# Altium schematic sheet 32.SchDoc
size 594 x 420 mm; Scale: 1:1; Разраб.: Иванов; Обозначение документа: ГУИР.203719.145 Э3; Пров.: Петров; Утв.: Сидоров; Номер листа: 26; Наименование организации: ОАО "Концерн "МПО-Гидроприбор"; Наименование изделия 1: Плата; Наименование изделия 2: Схема электрическая; Наименование изделия 3: принципиальная; Нач. отд.: Нач. отд.; Фамилия нач. отд.: Сидоров
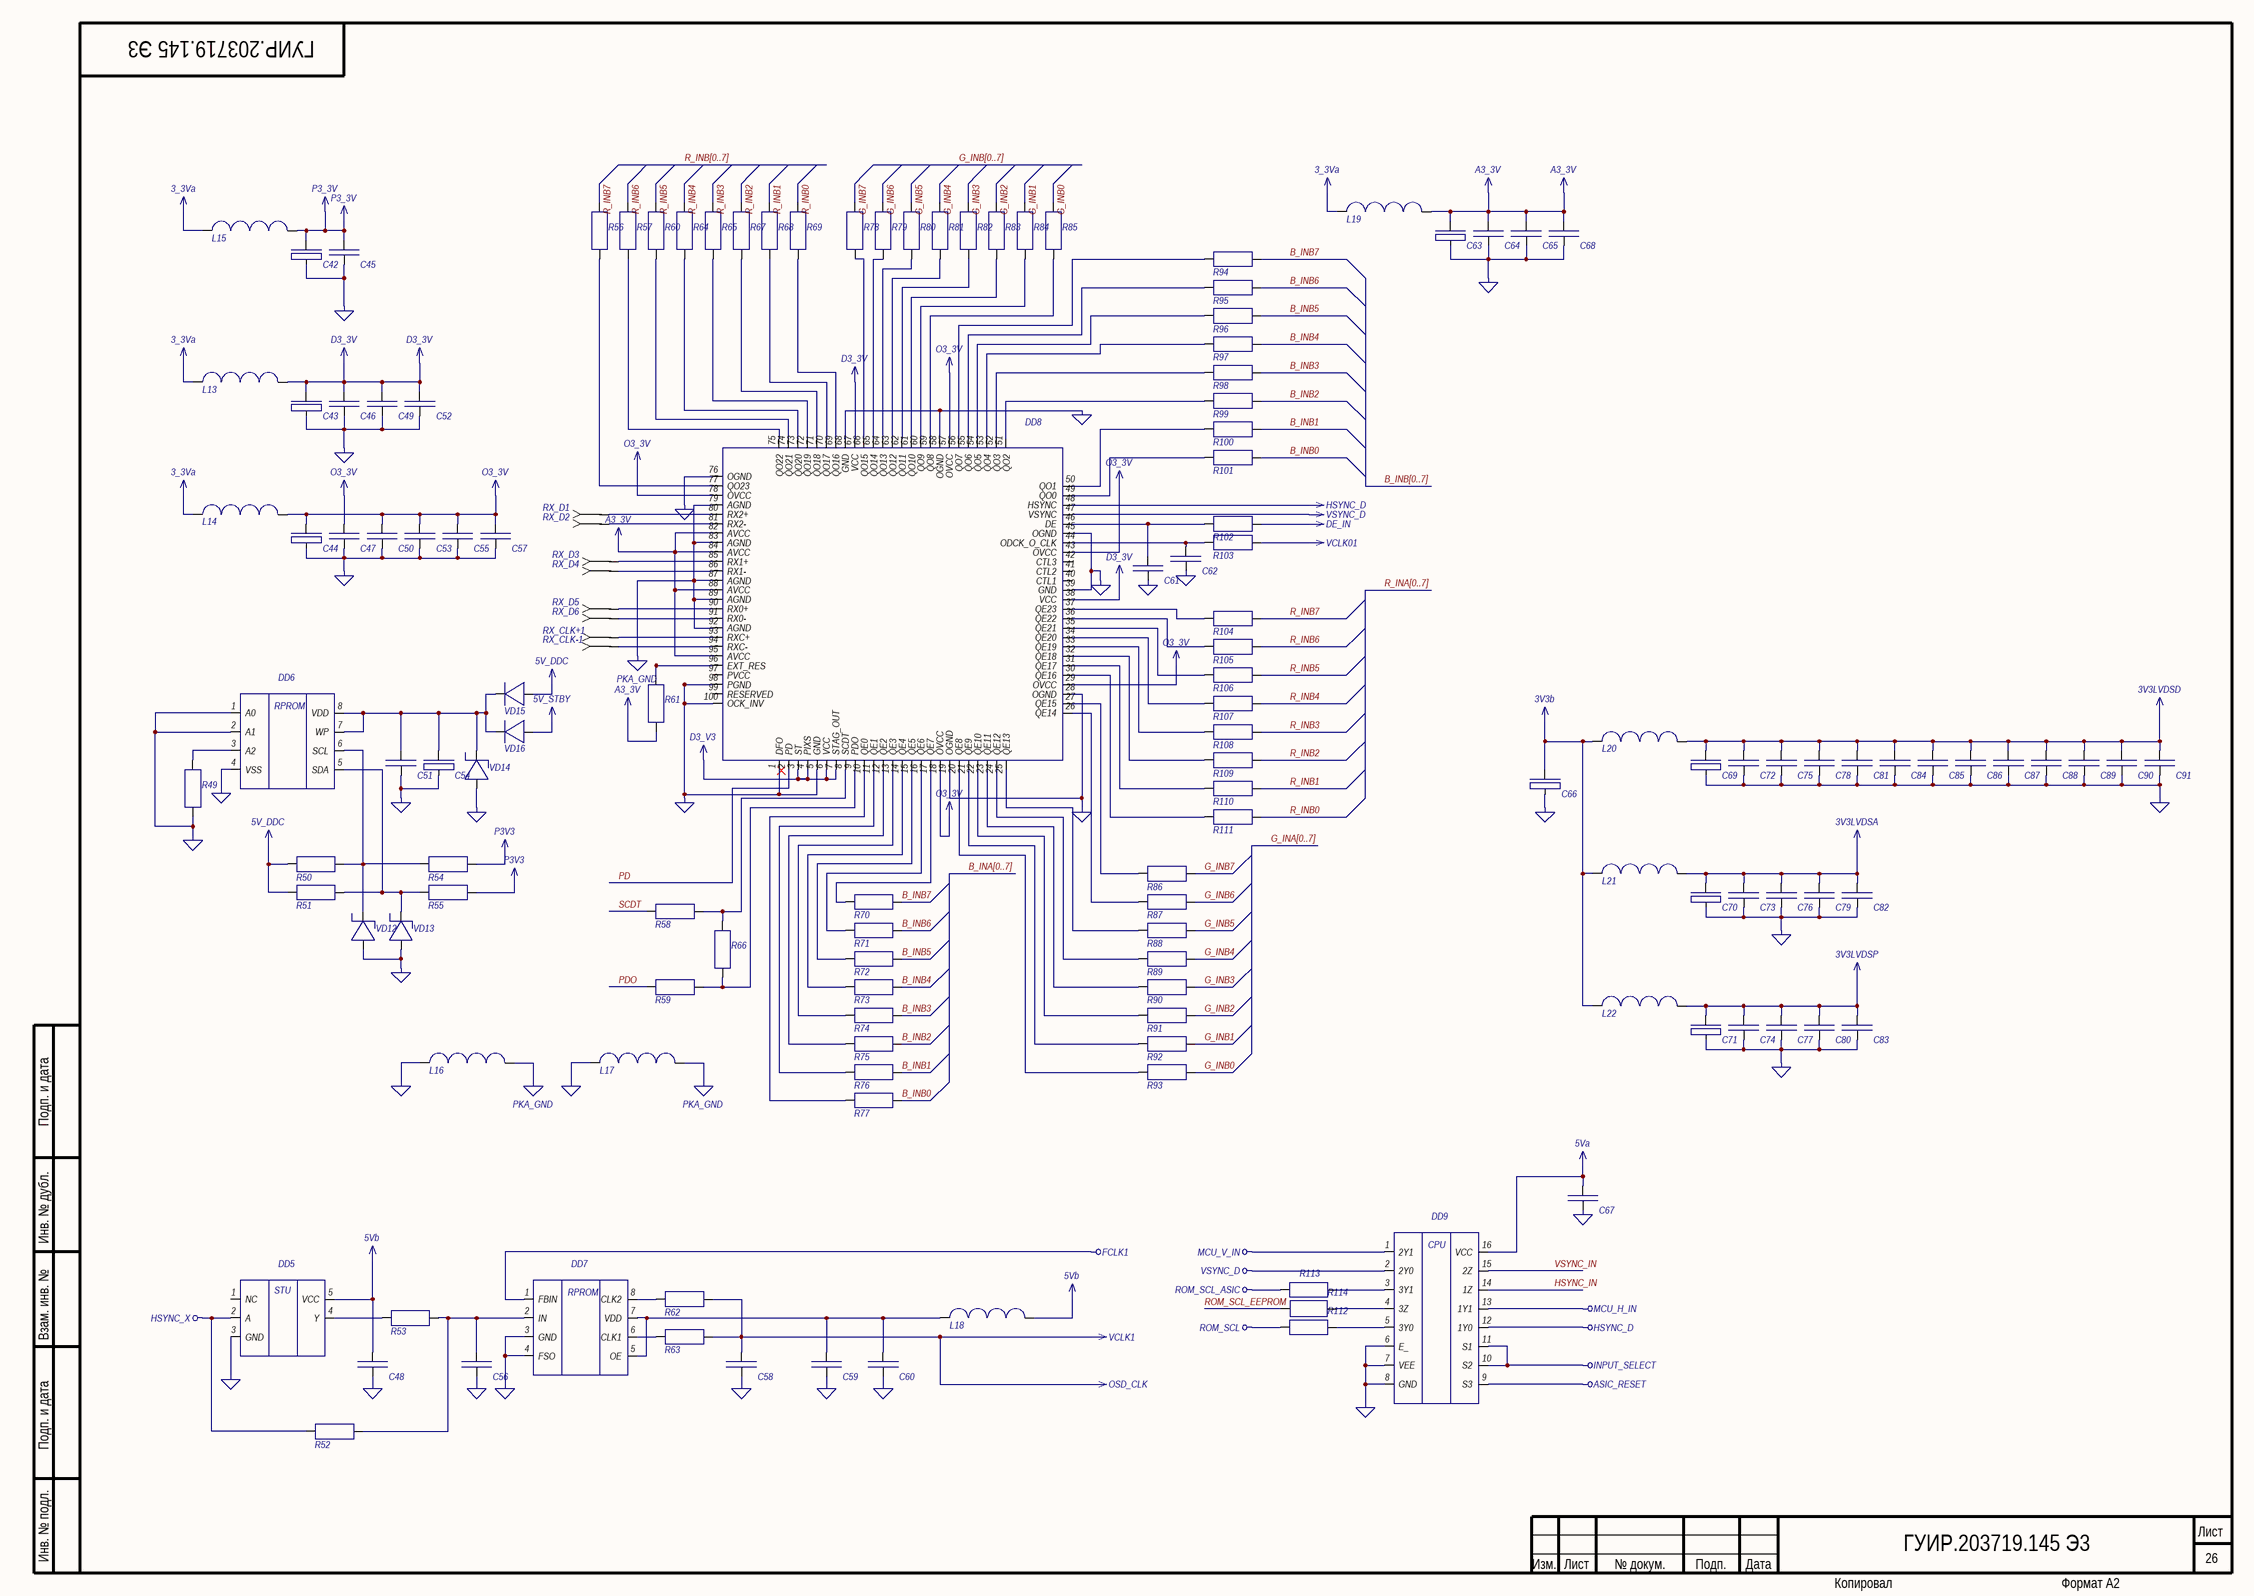
[diagram p0: 32.SchDoc]

## Parts
C42  TuningCapacitor  [Cap_tantal_D]  (value not drawn)
C43  TuningCapacitor  [Cap_tantal_D]  (value not drawn)
C44  TuningCapacitor  [Cap_tantal_D]  (value not drawn)
C45  Capacitor  [cap_electro_13]  (value not drawn)
C46  Capacitor  [cap_electro_13]  (value not drawn)
C47  Capacitor  [cap_electro_13]  (value not drawn)
C48  Capacitor  [cap_electro_13]  (value not drawn)
C49  Capacitor  [cap_electro_13]  (value not drawn)
C50  Capacitor  [cap_electro_13]  (value not drawn)
C51  Capacitor  [cap_electro_13]  (value not drawn)
C52  Capacitor  [cap_electro_13]  (value not drawn)
C53  Capacitor  [cap_electro_13]  (value not drawn)
C54  TuningCapacitor  [Cap_tantal_D]  (value not drawn)
C55  Capacitor  [cap_electro_13]  (value not drawn)
C56  Capacitor  [cap_electro_13]  (value not drawn)
C57  Capacitor  [cap_electro_13]  (value not drawn)
C58  Capacitor  [cap_electro_13]  (value not drawn)
C59  Capacitor  [cap_electro_13]  (value not drawn)
C60  Capacitor  [cap_electro_13]  (value not drawn)
C61  Capacitor  [cap_electro_13]  (value not drawn)
C62  Capacitor  [cap_electro_13]  (value not drawn)
C63  TuningCapacitor  [Cap_tantal_D]  (value not drawn)
C64  Capacitor  [cap_electro_13]  (value not drawn)
C65  Capacitor  [cap_electro_13]  (value not drawn)
C66  TuningCapacitor  [Cap_tantal_D]  (value not drawn)
C67  Capacitor  [cap_electro_13]  (value not drawn)
C68  Capacitor  [cap_electro_13]  (value not drawn)
C69  TuningCapacitor  [Cap_tantal_D]  (value not drawn)
C70  TuningCapacitor  [Cap_tantal_D]  (value not drawn)
C71  TuningCapacitor  [Cap_tantal_D]  (value not drawn)
C72  Capacitor  [cap_electro_13]  (value not drawn)
C73  Capacitor  [cap_electro_13]  (value not drawn)
C74  Capacitor  [cap_electro_13]  (value not drawn)
C75  Capacitor  [cap_electro_13]  (value not drawn)
C76  Capacitor  [cap_electro_13]  (value not drawn)
C77  Capacitor  [cap_electro_13]  (value not drawn)
C78  Capacitor  [cap_electro_13]  (value not drawn)
C79  Capacitor  [cap_electro_13]  (value not drawn)
C80  Capacitor  [cap_electro_13]  (value not drawn)
C81  Capacitor  [cap_electro_13]  (value not drawn)
C82  Capacitor  [cap_electro_13]  (value not drawn)
C83  Capacitor  [cap_electro_13]  (value not drawn)
C84  Capacitor  [cap_electro_13]  (value not drawn)
C85  Capacitor  [cap_electro_13]  (value not drawn)
C86  Capacitor  [cap_electro_13]  (value not drawn)
C87  Capacitor  [cap_electro_13]  (value not drawn)
C88  Capacitor  [cap_electro_13]  (value not drawn)
C89  Capacitor  [cap_electro_13]  (value not drawn)
C90  Capacitor  [cap_electro_13]  (value not drawn)
C91  Capacitor  [cap_electro_13]  (value not drawn)
DD5  F14-SINGLE  [74AHC1G14(SOT25)]  (value not drawn)
DD6  24C02  [24Cxx]  (value not drawn)
DD7  AV9173-01  [AV9173-01(DIP8)]  (value not drawn)
DD8  SIL151  [SIL151]  (value not drawn)
DD9  74LV4053  [74LV4053(SOT38-4)]  (value not drawn)
L13  Inductor  [inductor]  (value not drawn)
L14  Inductor  [inductor]  (value not drawn)
L15  Inductor  [inductor]  (value not drawn)
L16  Inductor  [inductor]  (value not drawn)
L17  Inductor  [inductor]  (value not drawn)
L18  Inductor  [inductor]  (value not drawn)
L19  Inductor  [inductor]  (value not drawn)
L20  Inductor  [inductor]  (value not drawn)
L21  Inductor  [inductor]  (value not drawn)
L22  Inductor  [inductor]  (value not drawn)
R49  Resistor  [R_1206]  (value not drawn)
R50  Resistor  [R_1206]  (value not drawn)
R51  Resistor  [R_1206]  (value not drawn)
R52  Resistor  [R_1206]  (value not drawn)
R53  Resistor  [R_1206]  (value not drawn)
R54  Resistor  [R_1206]  (value not drawn)
R55  Resistor  [R_1206]  (value not drawn)
R56  Resistor  [R_1206]  (value not drawn)
R57  Resistor  [R_1206]  (value not drawn)
R58  Resistor  [R_1206]  (value not drawn)
R59  Resistor  [R_1206]  (value not drawn)
R60  Resistor  [R_1206]  (value not drawn)
R61  Resistor  [R_1206]  (value not drawn)
R62  Resistor  [R_1206]  (value not drawn)
R63  Resistor  [R_1206]  (value not drawn)
R64  Resistor  [R_1206]  (value not drawn)
R65  Resistor  [R_1206]  (value not drawn)
R66  Resistor  [R_1206]  (value not drawn)
R67  Resistor  [R_1206]  (value not drawn)
R68  Resistor  [R_1206]  (value not drawn)
R69  Resistor  [R_1206]  (value not drawn)
R70  Resistor  [R_1206]  (value not drawn)
R71  Resistor  [R_1206]  (value not drawn)
R72  Resistor  [R_1206]  (value not drawn)
R73  Resistor  [R_1206]  (value not drawn)
R74  Resistor  [R_1206]  (value not drawn)
R75  Resistor  [R_1206]  (value not drawn)
R76  Resistor  [R_1206]  (value not drawn)
R77  Resistor  [R_1206]  (value not drawn)
R78  Resistor  [R_1206]  (value not drawn)
R79  Resistor  [R_1206]  (value not drawn)
R80  Resistor  [R_1206]  (value not drawn)
R81  Resistor  [R_1206]  (value not drawn)
R82  Resistor  [R_1206]  (value not drawn)
R83  Resistor  [R_1206]  (value not drawn)
R84  Resistor  [R_1206]  (value not drawn)
R85  Resistor  [R_1206]  (value not drawn)
R86  Resistor  [R_1206]  (value not drawn)
R87  Resistor  [R_1206]  (value not drawn)
R88  Resistor  [R_1206]  (value not drawn)
R89  Resistor  [R_1206]  (value not drawn)
R90  Resistor  [R_1206]  (value not drawn)
R91  Resistor  [R_1206]  (value not drawn)
R92  Resistor  [R_1206]  (value not drawn)
R93  Resistor  [R_1206]  (value not drawn)
R94  Resistor  [R_1206]  (value not drawn)
R95  Resistor  [R_1206]  (value not drawn)
R96  Resistor  [R_1206]  (value not drawn)
R97  Resistor  [R_1206]  (value not drawn)
R98  Resistor  [R_1206]  (value not drawn)
R99  Resistor  [R_1206]  (value not drawn)
R100  Resistor  [R_1206]  (value not drawn)
R101  Resistor  [R_1206]  (value not drawn)
R102  Resistor  [R_1206]  (value not drawn)
R103  Resistor  [R_1206]  (value not drawn)
R104  Resistor  [R_1206]  (value not drawn)
R105  Resistor  [R_1206]  (value not drawn)
R106  Resistor  [R_1206]  (value not drawn)
R107  Resistor  [R_1206]  (value not drawn)
R108  Resistor  [R_1206]  (value not drawn)
R109  Resistor  [R_1206]  (value not drawn)
R110  Resistor  [R_1206]  (value not drawn)
R111  Resistor  [R_1206]  (value not drawn)
R112  Resistor  [R_1206]  (value not drawn)
R113  Resistor  [R_1206]  (value not drawn)
R114  Resistor  [R_1206]  (value not drawn)
RX_CLK+1  InputArrow  [ARROW]  (value not drawn)
RX_CLK-1  InputArrow  [ARROW]  (value not drawn)
RX_D1  InputArrow  [ARROW]  (value not drawn)
RX_D2  InputArrow  [ARROW]  (value not drawn)
RX_D3  InputArrow  [ARROW]  (value not drawn)
RX_D4  InputArrow  [ARROW]  (value not drawn)
RX_D5  InputArrow  [ARROW]  (value not drawn)
RX_D6  InputArrow  [ARROW]  (value not drawn)
VD12  DiodeSchottky  [zener_diode]  (value not drawn)
VD13  DiodeSchottky  [zener_diode]  (value not drawn)
VD14  DiodeSchottky  [zener_diode]  (value not drawn)
VD15  Diode  [zener_diode]  (value not drawn)
VD16  Diode  [zener_diode]  (value not drawn)

## Nets
3_3Va: L13.1 L14.1 L15.1 L19.1
3V3b: C66.1 L20.1 L21.1 L22.1
3V3LVDSA: C70.1 C73.2 C76.2 C79.2 C82.2 L21.2
3V3LVDSD: C69.1 C72.2 C75.2 C78.2 C81.2 C84.2 C85.2 C86.2 C87.2 C88.2 C89.2 C90.2 C91.2 L20.2
3V3LVDSP: C71.1 C74.2 C77.2 C80.2 C83.2 L22.2
5V_DDC: R50.2 R51.2 VD15.1
5V_STBY: VD16.1
5Va: C67.2 DD9.16(VCC)
5Vb: C48.1 DD5.5(VCC) L18.2
A3_3V: C63.1 C64.2 C65.2 C68.2 DD8.82(AVCC) DD8.84(AVCC) DD8.88(AVCC) DD8.95(AVCC) L19.2 R61.1
ASIC_RESET: DD9.9(S3)
D3_3V: C43.1 C46.2 C49.2 C52.2 DD8.38(VCC) DD8.67(VCC) L13.2
D3_V3: DD8.3(ST) DD8.4(PIXS) DD8.6(VCC) DD8.7(STAG_OUT)
DE_IN: R102.2
FCLK1: DD7.1(FBIN)
GND: C42.2 C43.2 C44.2 C45.1 C46.1 C47.1 C48.2 C49.1 C50.1 C51.1 C52.1 C53.1 C54.2 C55.1 C56.2 C57.1 C58.2 C59.2 C60.2 C61.1 C62.1 C63.2 C64.1 C65.1 C66.2 C67.1 C68.1 C69.2 C70.2 C71.2 C72.1 C73.1 C74.1 C75.1 C76.1 C77.1 C78.1 C79.1 C80.1 C81.1 C82.1 C83.1 C84.1 C85.1 C86.1 C87.1 C88.1 C89.1 C90.1 C91.1 DD5.3(GND) DD6.1(A0) DD6.2(A1) DD6.4(VSS) DD7.3(GND) DD7.4(FSO) DD8.1(DFO) DD8.5(GND) DD8.19(OGND) DD8.28(OGND) DD8.39(GND) DD8.45(OGND) DD8.58(OGND) DD8.68(GND) DD8.76(OGND) DD8.98(PGND) DD8.100(OCK_INV) DD9.6(E_) DD9.7(VEE) DD9.8(GND) L16.1 L17.1 R49.1 VD12.1 VD13.1 VD14.1
HSYNC_D: DD8.48(HSYNC) DD9.12(1Y0)
HSYNC_X: DD5.2(A) R52.1
INPUT_SELECT: DD9.10(S2) DD9.11(S1)
MCU_H_IN: DD9.13(1Y1)
MCU_V_IN: DD9.1(2Y1)
O3_3V: C44.1 C47.2 C50.2 C53.2 C55.2 C57.2 DD8.18(OVCC) DD8.29(OVCC) DD8.43(OVCC) DD8.57(OVCC) DD8.78(OVCC) L14.2
OSD_CLK: C58.1 R62.2 R63.2  [also labelled VCLK1]
P3_3V: C42.1 C45.2 L15.2
P3V3: R54.1 R55.1
PKA_GND: DD8.79(AGND) DD8.83(AGND) DD8.87(AGND) DD8.89(AGND) DD8.92(AGND) L16.2 L17.2
ROM_SCL: R112.1
ROM_SCL_ASIC: R113.1
VCLK01: R103.2
VSYNC_D: DD8.47(VSYNC) DD9.2(2Y0)
B_INB0: R77.2 R101.2
B_INB1: R76.2 R100.2
B_INB2: R75.2 R99.2
B_INB3: R74.2 R98.2
B_INB4: R73.2 R97.2
B_INB5: R72.2 R96.2
B_INB6: R71.2 R95.2
B_INB7: R70.2 R94.2
G_INB0: R85.2 R93.2
G_INB1: R84.2 R92.2
G_INB2: R83.2 R91.2
G_INB3: R82.2 R90.2
G_INB4: R81.2 R89.2  [also labelled G_INB[0..7]]
G_INB5: R80.2 R88.2
G_INB6: R79.2 R87.2
G_INB7: R78.2 R86.2
HSYNC_IN: DD9.14(1Z)
PD: DD8.2(PD)
PDO: R59.2
R_INB0: R69.2 R111.2
R_INB1: R68.2 R110.2
R_INB2: R67.2 R109.2
R_INB3: R65.2 R108.2
R_INB4: R64.2 R107.2
R_INB5: R60.2 R106.2
R_INB6: R57.2 R105.2
R_INB7: R56.2 R104.2
ROM_SCL_EEPROM: R114.2
SCDT: R58.2
VSYNC_IN: DD9.15(2Z)
NetC51_2: C51.2 C54.1 DD6.7(WP) DD6.8(VDD) VD14.2 VD15.2 VD16.2
NetC56_1: C56.1 DD7.2(IN) R52.2 R53.2
NetC59_1: C59.1 C60.1 DD7.5(OE) DD7.7(VDD) L18.1
NetC61_2: C61.2 DD8.46(DE) R102.1
NetC62_2: C62.2 DD8.44(ODCK_O_CLK) R103.1
NetDD5_4: DD5.4(Y) R53.1
NetDD6_3: DD6.3(A2) R49.2
NetDD6_5: DD6.5(SDA) R51.1 R55.2 VD13.2
NetDD6_6: DD6.6(SCL) R50.1 R54.2 VD12.2
NetDD7_6: DD7.6(CLK1) R63.1
NetDD7_8: DD7.8(CLK2) R62.1
NetDD8_8: DD8.8(SCDT) R58.1 R66.2
NetDD8_9: DD8.9(PDO) R59.1 R66.1
NetDD8_10: DD8.10(QE0) R77.1
NetDD8_11: DD8.11(QE1) R76.1
NetDD8_12: DD8.12(QE2) R75.1
NetDD8_13: DD8.13(QE3) R74.1
NetDD8_14: DD8.14(QE4) R73.1
NetDD8_15: DD8.15(QE5) R72.1
NetDD8_16: DD8.16(QE6) R71.1
NetDD8_17: DD8.17(QE7) R70.1
NetDD8_20: DD8.20(QE8) R93.1
NetDD8_21: DD8.21(QE9) R92.1
NetDD8_22: DD8.22(QE10) R91.1
NetDD8_23: DD8.23(QE11) R90.1
NetDD8_24: DD8.24(QE12) R89.1
NetDD8_25: DD8.25(QE13) R88.1
NetDD8_26: DD8.26(QE14) R87.1
NetDD8_27: DD8.27(QE15) R86.1
NetDD8_30: DD8.30(QE16) R111.1
NetDD8_31: DD8.31(QE17) R110.1
NetDD8_32: DD8.32(QE18) R109.1
NetDD8_33: DD8.33(QE19) R108.1
NetDD8_34: DD8.34(QE20) R107.1
NetDD8_35: DD8.35(QE21) R106.1
NetDD8_36: DD8.36(QE22) R105.1
NetDD8_37: DD8.37(QE23) R104.1
NetDD8_49: DD8.49(QO0) R101.1
NetDD8_50: DD8.50(QO1) R100.1
NetDD8_51: DD8.51(QO2) R99.1
NetDD8_52: DD8.52(QO3) R98.1
NetDD8_53: DD8.53(QO4) R97.1
NetDD8_54: DD8.54(QO5) R96.1
NetDD8_55: DD8.55(QO6) R95.1
NetDD8_56: DD8.56(QO7) R94.1
NetDD8_59: DD8.59(QO8) R85.1
NetDD8_60: DD8.60(QO9) R84.1
NetDD8_61: DD8.61(QO10) R83.1
NetDD8_62: DD8.62(QO11) R82.1
NetDD8_63: DD8.63(QO12) R81.1
NetDD8_64: DD8.64(QO13) R80.1
NetDD8_65: DD8.65(QO14) R79.1
NetDD8_66: DD8.66(QO15) R78.1
NetDD8_69: DD8.69(QO16) R69.1
NetDD8_70: DD8.70(QO17) R68.1
NetDD8_71: DD8.71(QO18) R67.1
NetDD8_72: DD8.72(QO19) R65.1
NetDD8_73: DD8.73(QO20) R64.1
NetDD8_74: DD8.74(QO21) R60.1
NetDD8_75: DD8.75(QO22) R57.1
NetDD8_77: DD8.77(QO23) R56.1
NetDD8_80: DD8.80(RX2+) RX_D1.1
NetDD8_81: DD8.81(RX2-) RX_D2.1
NetDD8_85: DD8.85(RX1+) RX_D3.1
NetDD8_86: DD8.86(RX1-) RX_D4.1
NetDD8_90: DD8.90(RX0+) RX_D5.1
NetDD8_91: DD8.91(RX0-) RX_D6.1
NetDD8_93: DD8.93(RXC+) RX_CLK+1.1
NetDD8_94: DD8.94(RXC-) RX_CLK-1.1
NetDD8_96: DD8.96(EXT_RES) R61.2
NetDD9_3: DD9.3(3Y1) R113.2
NetDD9_4: DD9.4(3Z) R114.1
NetDD9_5: DD9.5(3Y0) R112.2

Not connected (* = marked no-connect by the designer): DD5 1(NC); DD8 40(CTL1) 41(CTL2) 42(CTL3) 97(PVCC) 99(RESERVED)

## Buses and harness runs
bus B_INA[0..7]
bus B_INB[0..7]
bus G_INA[0..7]
bus R_INA[0..7]
bus R_INB[0..7]

## Notes on the sheet
- Подп. и дата
- Инв. № дубл.
- Взам. инв. №
- Инв. № подл.
- Изм.
- Лист
- № докум.
- Подп.
- Дата
- Копировал
- Формат А2
- (in symbol 24C02) RPROM
- (in symbol 74AHC1G14-TA) STU
- (in symbol 74LV4053) CPU
- (in symbol AV9173-01) RPROM

## Library data of the parts
DD5 = 74AHC1G14-TA